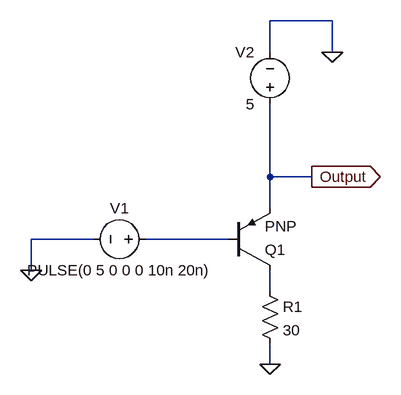
[diagram p0: schematic inverter.asc]
inverter.asc, the LTspice schematic file:
Version 4.1
SHEET 1 880 680
WIRE 288 -192 192 -192
WIRE 192 -144 192 -192
WIRE 288 -144 288 -192
WIRE 192 48 192 -64
WIRE 256 48 192 48
WIRE 192 96 192 48
WIRE -80 144 -176 144
WIRE 128 144 0 144
WIRE -176 192 -176 144
WIRE 192 224 192 192
WIRE 192 336 192 304
FLAG 192 336 0
FLAG -176 192 0
FLAG 288 -144 0
FLAG 256 48 Output
IOPIN 256 48 Out
SYMBOL pnp 128 192 M180
SYMATTR InstName Q1
SYMBOL res 176 208 R0
SYMATTR InstName R1
SYMATTR Value 30
SYMBOL voltage 16 144 R90
WINDOW 0 -32 56 VBottom 2
WINDOW 3 32 56 VTop 2
WINDOW 123 0 0 Left 0
WINDOW 39 0 0 Left 0
SYMATTR InstName V1
SYMATTR Value PULSE(0 5 0 0 0 10n 20n)
SYMBOL voltage 192 -48 R180
WINDOW 0 24 96 Left 2
WINDOW 3 24 16 Left 2
WINDOW 123 0 0 Left 0
WINDOW 39 0 0 Left 0
SYMATTR InstName V2
SYMATTR Value 5

The netlist it stands for:
* inverter.asc
Q1 N002 N001 Output 0 PNP
R1 N002 0 30
V1 N001 0 PULSE(0 5 0 0 0 10n 20n)
V2 Output 0 5
.model NPN NPN
.model PNP PNP
.lib standard.bjt
.backanno
.end